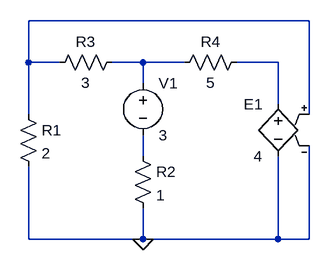
[diagram p0: schematic Draft14.asc]
Draft14.asc, the LTspice schematic file:
Version 4
SHEET 1 880 680
WIRE 496 -32 64 -32
WIRE 64 32 64 -32
WIRE 112 32 64 32
WIRE 240 32 192 32
WIRE 304 32 240 32
WIRE 448 32 384 32
WIRE 240 64 240 32
WIRE 448 96 448 32
WIRE 64 112 64 32
WIRE 496 112 496 -32
WIRE 240 176 240 144
WIRE 64 304 64 192
WIRE 240 304 240 256
WIRE 240 304 64 304
WIRE 448 304 448 176
WIRE 448 304 240 304
WIRE 496 304 496 160
WIRE 496 304 448 304
FLAG 240 304 0
SYMBOL res 48 96 R0
SYMATTR InstName R1
SYMATTR Value 2
SYMBOL res 224 160 R0
SYMATTR InstName R2
SYMATTR Value 1
SYMBOL res 208 16 R90
WINDOW 0 0 56 VBottom 2
WINDOW 3 32 56 VTop 2
SYMATTR InstName R3
SYMATTR Value 3
SYMBOL voltage 240 48 R0
SYMATTR InstName V1
SYMATTR Value 3
SYMBOL res 400 16 R90
WINDOW 0 0 56 VBottom 2
WINDOW 3 32 56 VTop 2
SYMATTR InstName R4
SYMATTR Value 5
SYMBOL e 448 80 M0
SYMATTR InstName E1
SYMATTR Value 4

The netlist it stands for:
* Draft14.asc
R1 N001 0 2
R2 N004 0 1
R3 N002 N001 3
V1 N002 N004 3
R4 N003 N002 5
E1 N003 0 N001 0 4
.backanno
.end